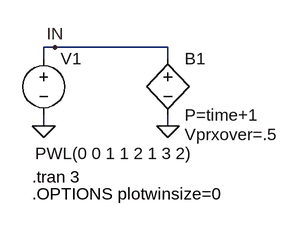
[diagram p0: schematic Fig_2-61_BP_Test-01.asc]
Fig_2-61_BP_Test-01.asc, the LTspice schematic file:
Version 4
SHEET 1 880 680
WIRE 112 144 96 144
WIRE 272 144 112 144
WIRE 96 160 96 144
WIRE 272 160 272 144
WIRE 96 256 96 240
WIRE 272 256 272 240
FLAG 96 256 0
FLAG 112 144 IN
FLAG 272 256 0
SYMBOL voltage 96 144 R0
WINDOW 3 -12 151 Left 2
WINDOW 123 0 0 Left 2
WINDOW 39 0 0 Left 2
SYMATTR Value PWL(0 0 1 1 2 1 3 2)
SYMATTR InstName V1
SYMBOL bv 272 144 R0
WINDOW 123 24 124 Left 2
SYMATTR Value2 Vprxover=.5
SYMATTR InstName B1
SYMATTR Value P=time+1
TEXT 80 328 Left 2 !.tran 3
TEXT 80 352 Left 2 !.OPTIONS plotwinsize=0

The netlist it stands for:
* Fig_2-61_BP_Test-01.asc
V1 IN 0 PWL(0 0 1 1 2 1 3 2)
B1 IN 0 P=time+1 Vprxover=.5
.tran 3
.OPTIONS plotwinsize=0
.backanno
.end